# Altium project final049.PrjPcb
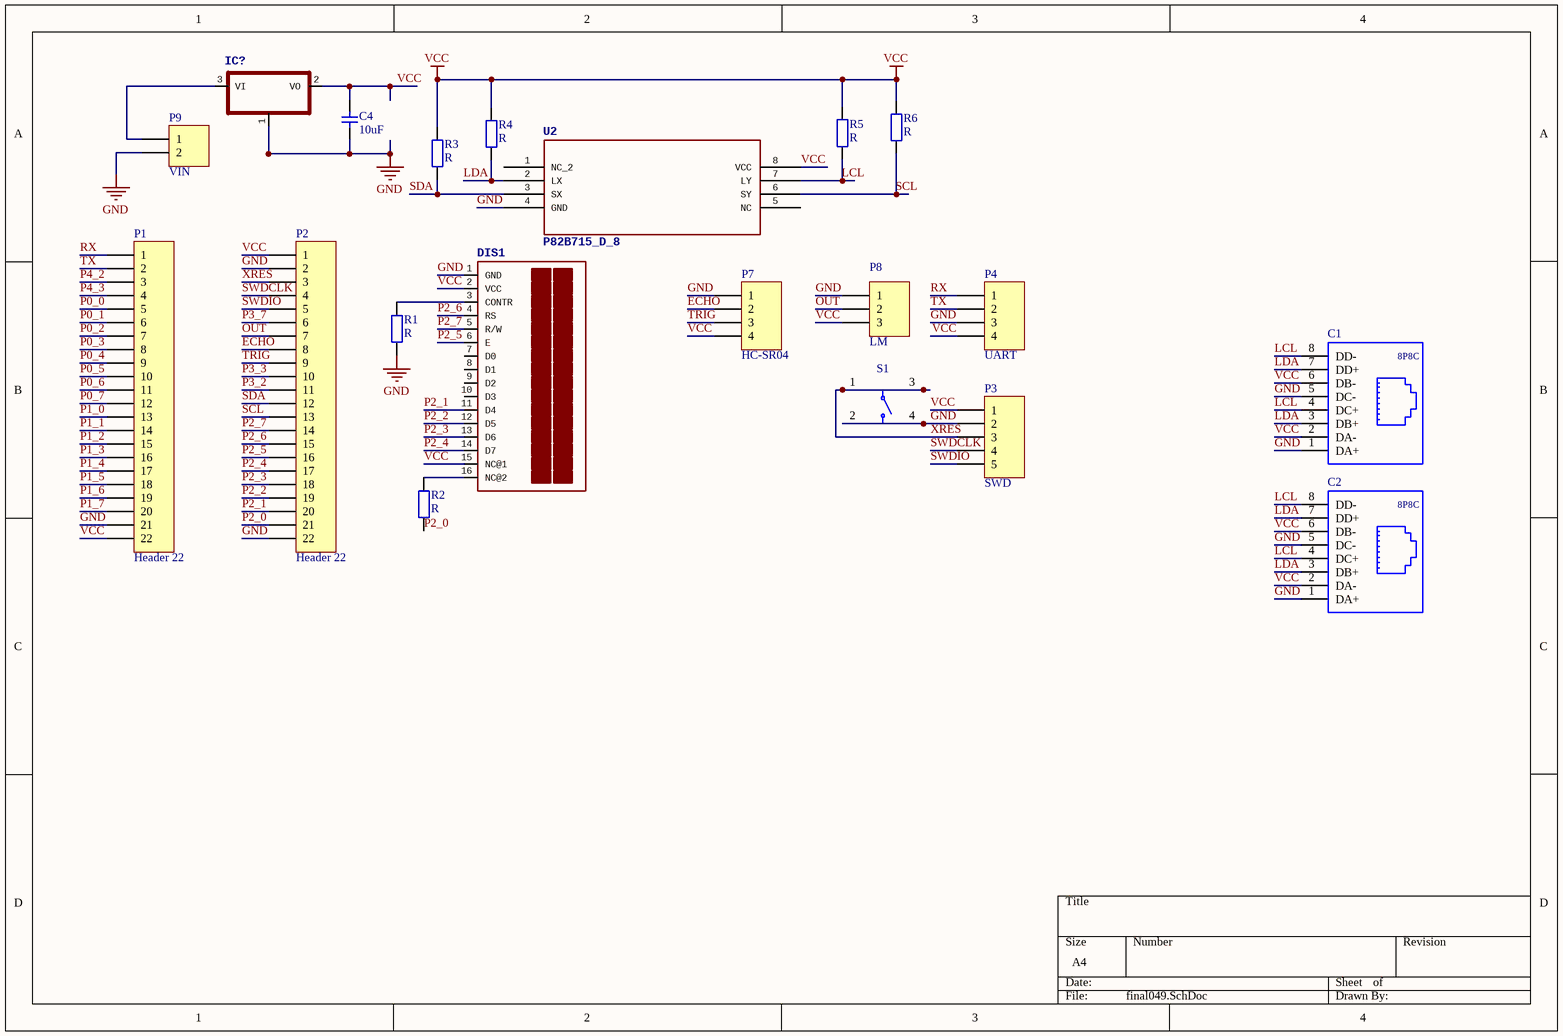
[diagram p0: final049.SchDoc]
1 sheet, 20 parts. Net scope: global (net labels, ports and power ports of the same name join across sheets).
Board file: PCB1.PcbDoc

## Sheet final049.SchDoc
size A4

### Parts
C1  WE-Modular Jack 615008148521  [615008148521]  (value not drawn)
C2  WE-Modular Jack 615008148521  [615008148521]  (value not drawn)
C4  10uF  [C0805-1.25]
DIS1  Tuxgraphics LCD display 16x2 characters reflective, without background light   Source: tuxgr_12x2_r2.pdf  [TUXGR_16X2_R2]  (value not drawn)
IC?  Adjustable Output Low Dropout Voltage Regulator 800 mA   Source: http://www.onsemi.com/pub/Collateral/MC33269-D.PDF  [DPACK]  (value not drawn)
P1  Header 22  [HDR1X22]
P2  Header 22  [HDR1X22]
P3  SWD  [HDR1X5]
P4  UART  [HDR1X4]
P7  HC-SR04  [HDR1X4]
P8  LM  [HDR1X3]
P9  VIN  [HDR1X2]
R1  R  [R1206-0.55]
R2  R  [R1206-0.55]
R3  R  [R1206-0.55]
R4  R  [R1206-0.55]
R5  R  [R1206-0.55]
R6  R  [R1206-0.55]
S1  (no value)  [4301x60437x6]
U2  P82B715_D_8  [D8]

### Nets
GND: C1.1(DA+) C1.5(DC-) C2.1(DA+) C2.5(DC-) C4.1 DIS1.1(GND) IC?.1(ADJ) P1.21 P2.2 P2.22 P3.2 P4.3 P7.1 P8.1 P9.2 R1.1 S1.2 S1.4 U2.4(GND)
VCC: C1.2(DA-) C1.6(DB-) C2.2(DA-) C2.6(DB-) C4.2 DIS1.2(VCC) DIS1.15(NC@1) IC?.2(VO) P1.22 P2.1 P3.1 P4.4 P7.4 P8.3 R3.2 R4.2 R5.2 R6.2 U2.8(VCC)
ECHO: P2.8 P7.2
LCL: C1.4(DC+) C1.8(DD-) C2.4(DC+) C2.8(DD-) R5.1 U2.7(LY)
LDA: C1.3(DB+) C1.7(DD+) C2.3(DB+) C2.7(DD+) R4.1 U2.2(LX)
OUT: P2.7 P8.2
P0_0: P1.5
P0_1: P1.6
P0_2: P1.7
P0_3: P1.8
P0_4: P1.9
P0_5: P1.10
P0_6: P1.11
P0_7: P1.12
P1_0: P1.13
P1_1: P1.14
P1_2: P1.15
P1_3: P1.16
P1_4: P1.17
P1_5: P1.18
P1_6: P1.19
P1_7: P1.20
P2_0: P2.21 R2.1
P2_1: DIS1.11(D4) P2.20
P2_2: DIS1.12(D5) P2.19
P2_3: DIS1.13(D6) P2.18
P2_4: DIS1.14(D7) P2.17
P2_5: DIS1.6(E) P2.16
P2_6: DIS1.4(RS) P2.15
P2_7: DIS1.5(R/W) P2.14
P3_2: P2.11
P3_3: P2.10
P3_7: P2.6
P4_2: P1.3
P4_3: P1.4
RX: P1.1 P4.1
SCL: P2.13 R6.1 U2.6(SY)
SDA: P2.12 R3.1 U2.3(SX)
SWDCLK: P2.4 P3.4
SWDIO: P2.5 P3.5
TRIG: P2.9 P7.3
TX: P1.2 P4.2
XRES: P2.3 P3.3 S1.1 S1.3
NetDIS1_3: DIS1.3(CONTR) R1.2
NetDIS1_16: DIS1.16(NC@2) R2.2
NetIC?_3: IC?.3(VI) P9.1

Not connected (* = marked no-connect by the designer): DIS1 7(D0) 8(D1) 9(D2) 10(D3); U2 1(NC_2) 5(NC)

### Notes on the sheet
- (in symbol WE-Modular Jack 615008148521) 8P8C

### Library data of the parts
C1 C2 = WE-Modular Jack 615008148521: WR-MJ_Modular Jacks_Plastic_8P8C; Manufacturer: W¨¹rth Elektronik eiSos GmbH; ComponentLink1 Description: Manufacturer; ComponentLink2 Description: Datasheet; NoPins: 8; ComponentLink1URL: http://www.we-online.de; ComponentLink2URL: http://katalog.we-online.de/em/datasheet/615008148521.pdf; Created by: Karrer Zheng; Created Date: 10/20/2014; partNo: 615008148521
C4 = C: Capacitor, generic
DIS1 = TUXGR_16X2_R2: OC_FARNELL: unknown; OC_NEWARK: unknown
IC? = MC33269?*D
P1 P2 = Header 22: Header, 22-Pin; LatestRevisionDate: 17-Jul-2002; LatestRevisionNote: Re-released for DXP Platform.; Publisher: Altium Limited
P3 = Header 5: Header, 5-Pin; LatestRevisionDate: 17-Jul-2002; LatestRevisionNote: Re-released for DXP Platform.; Publisher: Altium Limited
P4 P7 = Header 4: Header, 4-Pin; LatestRevisionDate: 17-Jul-2002; LatestRevisionNote: Re-released for DXP Platform.; Publisher: Altium Limited
P8 = Header 3: Header, 3-Pin; LatestRevisionDate: 17-Jul-2002; LatestRevisionNote: Re-released for DXP Platform.; Publisher: Altium Limited
P9 = Header 2: Header, 2-Pin; LatestRevisionDate: 17-Jul-2002; LatestRevisionNote: Re-released for DXP Platform.; Publisher: Altium Limited
R1-R6 = R: Resistor, generic
S1 = WS-TATV, 430186043716: WS-TATV 6x6 mm THT; Manufacturer: Wurth Elektronik; partNo: 430186043716; ComponentLink1Description: Manufacturer; ComponentLink1URL: http://www.we-online.de; Created by: Baojun Chen; Created Date: Dec.2015; ComponentLink2Description: Datasheet; ComponentLink2URL: http://katalog.we-online.de/em/datasheet/4301x6xxx7x6.pdf
U2 = P82B715_D_8: MANUFACTURER: Texas Instruments; FAMILY_NAME: I2C HUB, BUFFER, REPEATER; INDUSTRY_STD_PKG_TYPE: SOIC; PACKAGE_DESIGNATOR: D; PIN_COUNT: 8; DATASHEETURL: http://www.ti.com/lit/gpn/P82B715; GENERIC_PART_NUMBER: P82B715; MANUFACTURER_PART_NUMBER: p82b715_d_8; VENDOR: Texas Instruments